# EAGLE design electronicload (EAGLE 8.5.0)
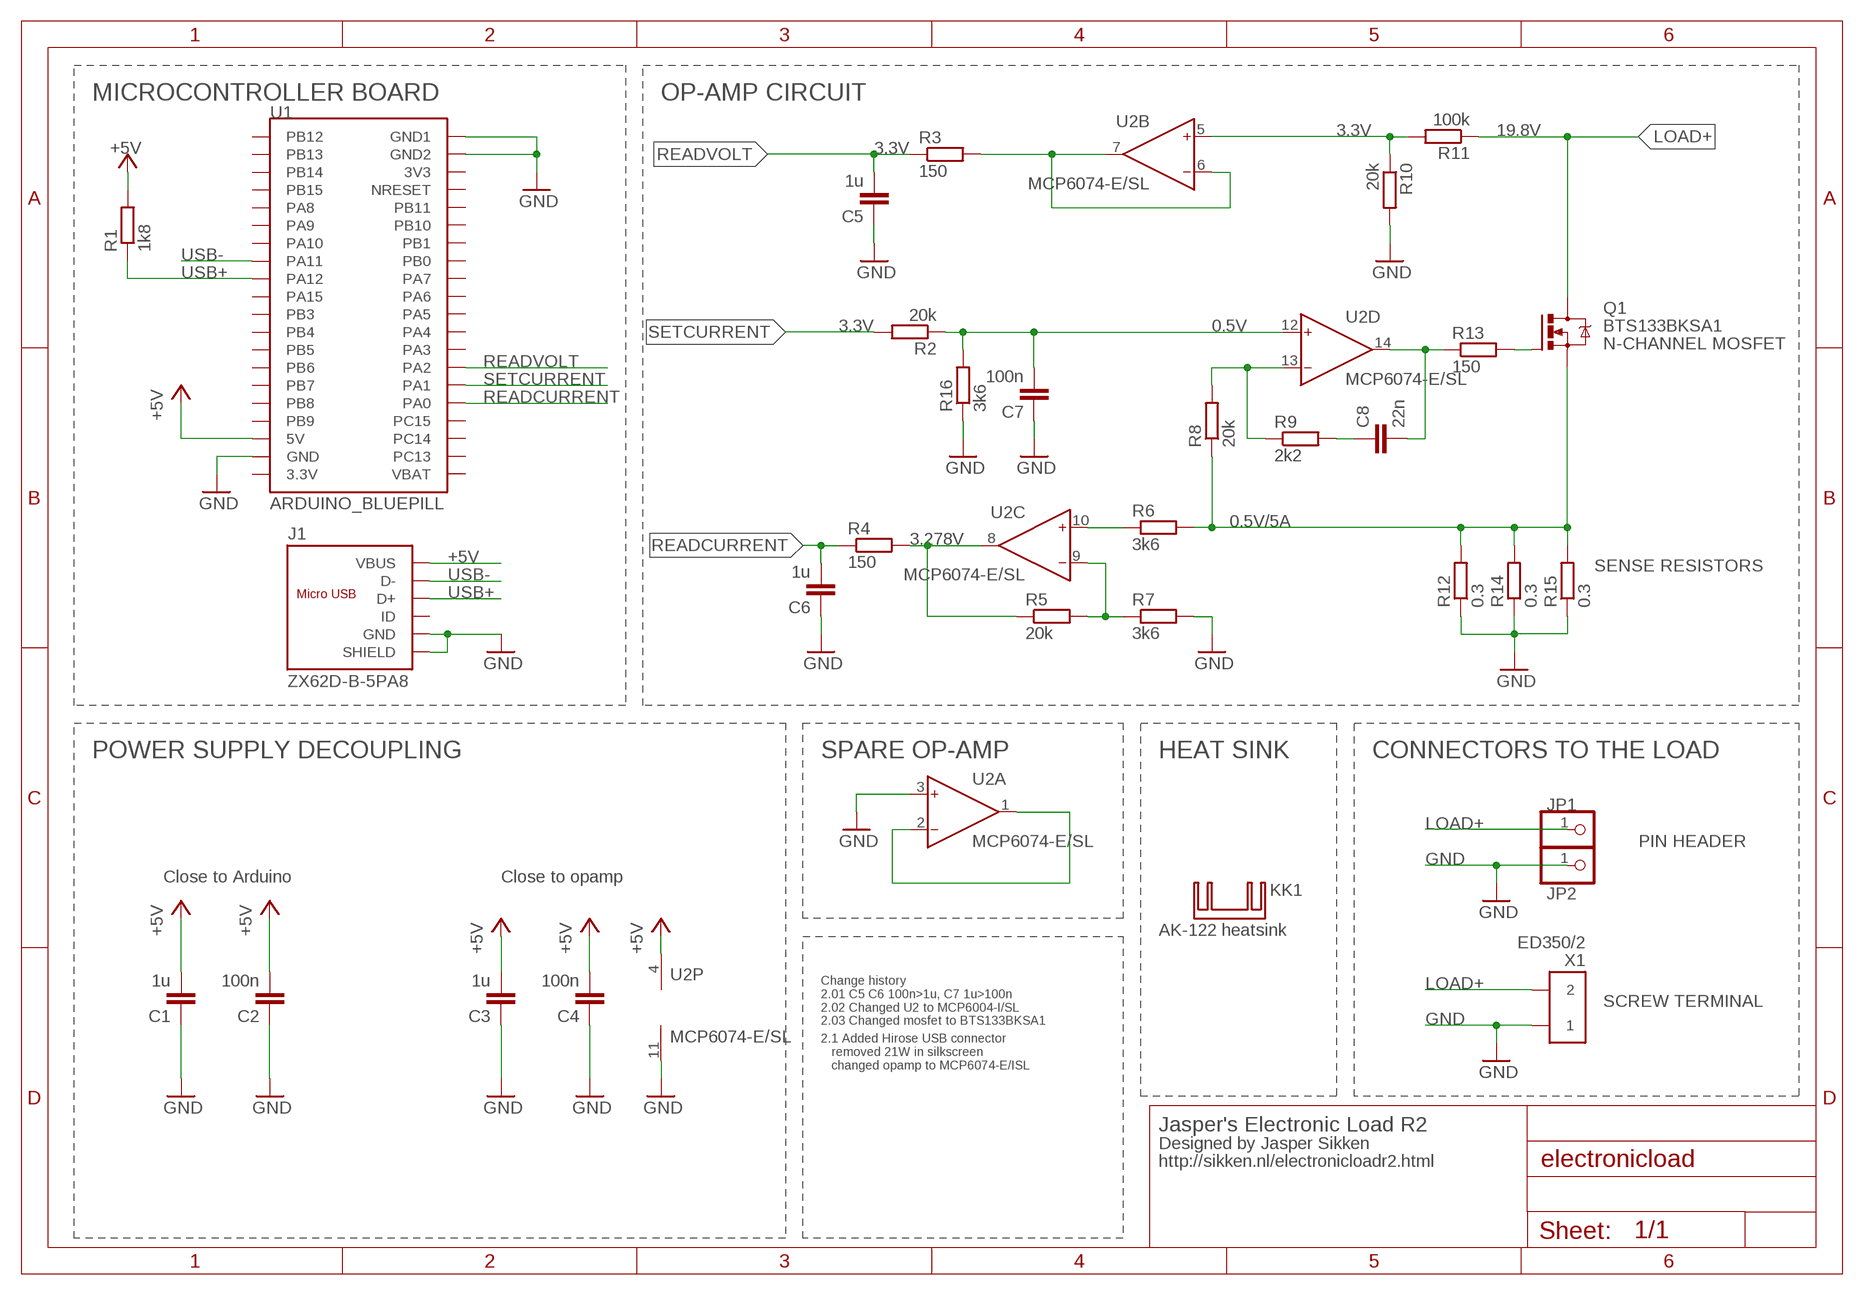
[diagram p0: schematic, sheet 1]

## Parts
C1  1u  C-EUC0603K  [C0603K]
C2  100n  C-EUC0603K  [C0603K]
C3  1u  C-EUC0603K  [C0603K]
C4  100n  C-EUC0603K  [C0603K]
C5  1u  C-EUC0603K  [C0603K]
C6  1u  C-EUC0603K  [C0603K]
C7  100n  C-EUC0603K  [C0603K]
C8  22n  C-EUC0603K  [C0603K]
J1  ZX62D-B-5PA8  MICRO-USB-SMD  [MICRO-USB5+6P-SMD-0.65-AB]
JP1  PINHD-1X1  [1X01]
JP2  PINHD-1X1  [1X01]
KK1  SK129  [SK129-HOLE]
Q1  BTS133BKSA1  IRLZ44Z  [TO220BV]
R1  1k8  R-EU_R0603  [R0603]
R2  20k  R-EU_R0603  [R0603]
R3  150  R-EU_R0603  [R0603]
R4  150  R-EU_R0603  [R0603]
R5  20k  R-EU_R0603  [R0603]
R6  3k6  R-EU_R0603  [R0603]
R7  3k6  R-EU_R0603  [R0603]
R8  20k  R-EU_R0603  [R0603]
R9  2k2  R-EU_R0603  [R0603]
R10  20k  R-EU_R0603  [R0603]
R11  100k  R-EU_R0603  [R0603]
R12  0.3  R2512_10R  [R2512]
R13  150  R-EU_R0603  [R0603]
R14  0.3  R2512_10R  [R2512]
R15  0.3  R2512_10R  [R2512]
R16  3k6  R-EU_R0603  [R0603]
U1  ARDUINO_BLUEPILL  [ARDUINO_BLUEPILL]
U2  MCP6074-E/SL  AD8608R  [SO14]
X1  ED350/2  [ED350/2]

## Nets
+5V: C1.2 C2.2 C3.2 C4.2 J1.1(VBUS) R1.2 U1.P$37(5V) U2.4(P:V+)
GATE: Q1.G R13.2
GND: C1.1 C2.1 C3.1 C4.1 C5.1 C6.1 C7.1 J1.5(GND) J1.P1(SHIELD) J1.P2(SHIELD) J1.P3(SHIELD) J1.P4(SHIELD) J1.P5(SHIELD) J1.P6(SHIELD) JP2.1 R7.2 R10.2 R12.1 R14.1 R15.1 R16.1 U1.P$18(GND2) U1.P$19(GND1) U1.P$38(GND) U2.3(A:IN+) U2.11(P:V-) X1.P$1
LOAD+: JP1.1 Q1.D R11.1 X1.P$2
N$1: C8.2 R13.1 U2.14(D:OUT)
N$2: R3.2 U2.6(B:IN-) U2.7(B:OUT)
N$3: R6.1 U2.10(C:IN+)
N$4: R8.2 R9.1 U2.13(D:IN-)
N$5: R10.1 R11.2 U2.5(B:IN+)
N$6: C7.2 R2.1 R16.2 U2.12(D:IN+)
N$7: R5.2 R7.1 U2.9(C:IN-)
N$9: R4.2 R5.1 U2.8(C:OUT)
N$12: C8.1 R9.2
N$20: U2.1(A:OUT) U2.2(A:IN-)
READCURRENT: C6.2 R4.1 U1.P$4(PA0)
READVOLT: C5.2 R3.1 U1.P$6(PA2)
SENSE: Q1.S R6.2 R8.1 R12.2 R14.2 R15.2
SETCURRENT: R2.2 U1.P$5(PA1)
USB+: J1.3(D+) R1.1 U1.P$28(PA12)
USB-: J1.2(D-) U1.P$27(PA11)
Unconnected: J1.4(ID) U1.P$0(VBAT) U1.P$1(PC13) U1.P$2(PC14) U1.P$3(PC15) U1.P$7(PA3) U1.P$8(PA4) U1.P$9(PA5) U1.P$10(PA6) U1.P$11(PA7) U1.P$12(PB0) U1.P$13(PB1) U1.P$14(PB10) U1.P$15(PB11) U1.P$16(NRESET) U1.P$17(3V3) U1.P$20(PB12) U1.P$21(PB13) U1.P$22(PB14) U1.P$23(PB15) U1.P$24(PA8) U1.P$25(PA9) U1.P$26(PA10) U1.P$29(PA15) U1.P$30(PB3) U1.P$31(PB4) U1.P$32(PB5) U1.P$33(PB6) U1.P$34(PB7) U1.P$35(PB8) U1.P$36(PB9) U1.P$39(3.3V)

## Notes on the sheet
- MICROCONTROLLER BOARD | OP-AMP CIRCUIT
- 3.3V | 19.8V
- 3.3V
- 3.3V | 0.5V
- N-CHANNEL MOSFET
- 0.5V/5A
- 3.278V
- SENSE RESISTORS
- POWER SUPPLY DECOUPLING | SPARE OP-AMP | HEAT SINK | CONNECTORS TO THE LOAD
- PIN HEADER
- Close to Arduino | Close to opamp
- AK-122 heatsink
- SCREW TERMINAL
- Change history
  2.01 C5 C6 100n>1u, C7 1u>100n
  2.02 Changed U2 to MCP6004-I/SL
  2.03 Changed mosfet to BTS133BKSA1
- 2.1 Added Hirose USB connector 
     removed 21W in silkscreen
     changed opamp to MCP6074-E/ISL
- Jasper's Electronic Load R2
- Designed by Jasper Sikken
- http://sikken.nl/electronicloadr2.html

## Library data of the parts
C1 C3 = rcl:C-EU: CAPACITOR, European symbol; DIGIKEY: 311-1444-1-ND; TEMPCOEFF: X5R; TOLERANCE: 10%; VOLTAGE: 16V
C2 C4-C6 = rcl:C-EU: CAPACITOR, European symbol; DIGIKEY: 445-7456-1-ND; TEMPCOEFF: X5R; TOLERANCE: 10%; VOLTAGE: 50V
C7 = rcl:C-EU: CAPACITOR, European symbol; DIGIKEY: 445-12511-1-ND; TEMPCOEFF: X5R; TOLERANCE: 10%; VOLTAGE: 50V
C8 = rcl:C-EU: CAPACITOR, European symbol; DIGIKEY: 445-12490-1-ND; TEMPCOEFF: X5R; TOLERANCE: 10%; VOLTAGE: 25V
J1 = sodaq:MICRO-USB-SMD: Micro USB connector; FARNELL_OC: 2554981; MF: Hirose; MPN: ZX62D-B-5PA8
JP1 JP2 = pinhead:PINHD-1X1: PIN HEADER
KK1 = heatsink:SK129: HEATSINK manufacturer Fischer/distributor Buerklin
Q1 = electronicload:IRLZ44Z: N-Channel HEXFET® Power MOSFET Logic Level AUTOMOTIVE MOSFET Source: http://www.irf.com/product-info/datasheets/data/irlz44zpbf.pdf; DIGIKEY: BTS133BKSA1-ND; FARNELL_OC: 2480556; MOUSER_OC: 726-BTS133BKSA1
R1 R2 R8 R16 = rcl:R-EU_: RESISTOR, European symbol; DIGIKEY: RMCF0603JT18K0CT-ND
R3 R4 R13 = rcl:R-EU_: RESISTOR, European symbol; DIGIKEY: RMCF0603JT150RCT-ND
R5 = rcl:R-EU_: RESISTOR, European symbol; DIGIKEY: RMCF0603JT180KCT-ND
R6 R7 R10 = rcl:R-EU_: RESISTOR, European symbol; DIGIKEY: RMCF0603JT20K0CT-ND
R9 = rcl:R-EU_: RESISTOR, European symbol; DIGIKEY: RMCF0603JT2K20CT-ND
R11 = rcl:R-EU_: RESISTOR, European symbol; DIGIKEY: RMCF0603JT100KCT-ND
R12 R14 R15 = sodaq:R: Resistor; FARNELL_OC: 2426553
U1 = electronicload:ARDUINO_BLUEPILL
U2 = electronicload:AD8608: Precision, Low Noise, CMOS, Rail-to-Rail, Input/Output Operational Amplifiers http://www.analog.com/static/imported-files/data_sheets/AD8605_8606_8608.pdf
X1 = electronicload:ED350/2: ED350/X (5.0 mm) TERMINAL BLOCK 5MM VERT 2POS PCB Datasheet http://www.on-shore.com/sites/default/files/manuals/edz350.pdf; DIGIKEY: ED1930-ND

## Board
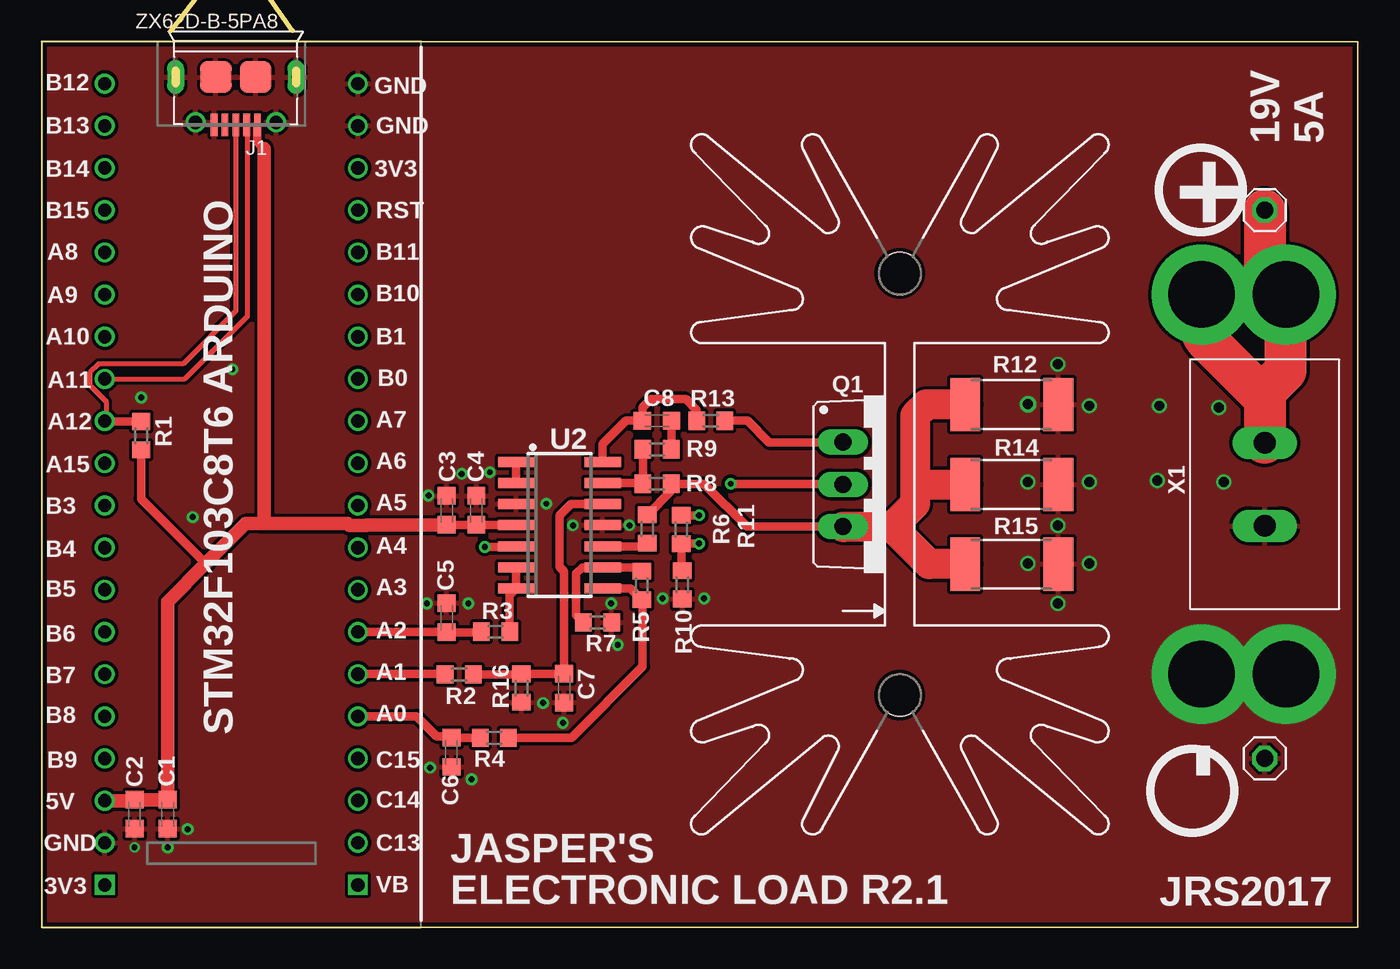
[diagram p1: board, top side]
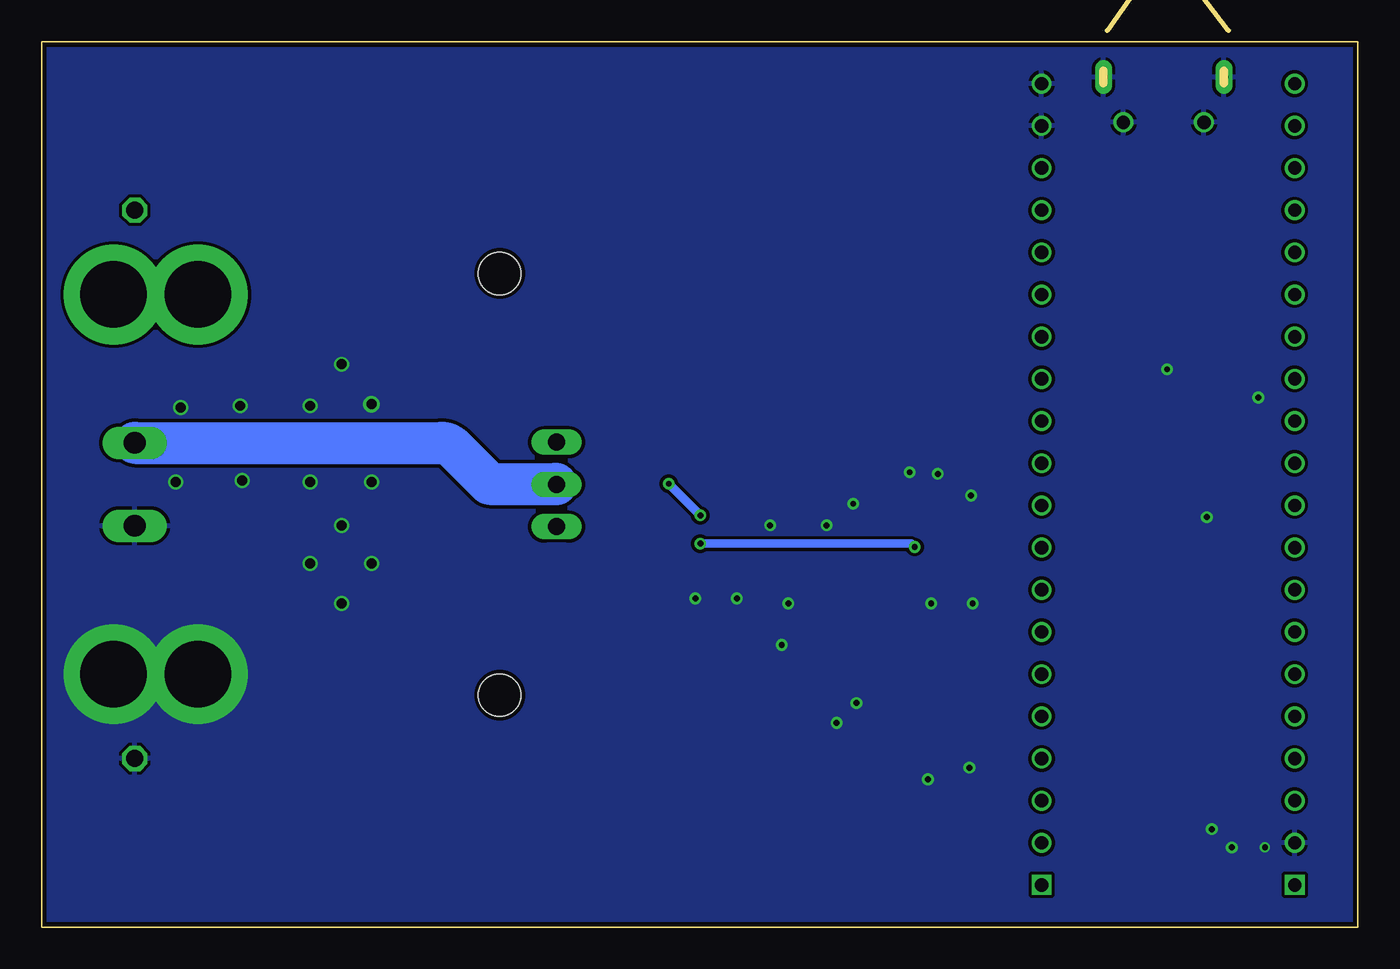
[diagram p2: board, bottom side, seen from below]

Size 79.27 x 53.34 mm. Coordinates in mm from the lower left corner, seen from the top.
Outline: 79.27,0 79.27,53.34 0,53.34 0,0 79.27,0
Copper layers (1*16): Top 0.018mm / dielectric 1.55mm / Bottom 0.018mm
Design rules "eC_2Layer_PClass6_BaseCopperO18_eCDefault (SODAQ EDIT) *": minimum track width 0.15mm, minimum drill 0.3mm, track to track 0.15mm, track to pad 0.15mm, pad to pad 0.15mm, via to via 0.15mm, smd to smd 0mil, copper to edge 0.25mm, drill to drill 0.3mm, minimum pad ring 0.175mm, minimum via ring 0.125mm, stop-mask expansion 0mil, vias tented up to drill 0.7mm, thermal gap 0.2mm
Milling: 2 lines

### Footprints (pad centres in the part's own frame; a part is rotated, then mirrored left to right if it is on the bottom)
C0603K = smd 1.05 x 1.08: 1 -0.875,0; 2 0.875,0
MICRO-USB5+6P-SMD-0.65-AB = smd 0.4 x 1.35: 1 -1.3,2.875; 2 -0.65,2.875; 3 0,2.875; 4 0.65,2.875; 5 1.3,2.875 | smd 1.9 x 1.9: P1 -1.2,0; P2 1.2,0 | drill 0.508 pad 1.016 long: P3 -3.625,0; P4 3.625,0 | drill 0.8: P5 -2.425,2.73; P6 2.425,2.73
1X01 = drill 1.016 octagon: 1 0,0
SK129-HOLE = hole 2.54: -12.7,-0.889; 12.7,-0.889
TO220BV = drill 1.016 long: D 0,-2.54; G -2.54,-2.54; S 2.54,-2.54
R0603 = smd 1 x 1.1: 1 -0.85,0; 2 0.85,0
R2512 = smd 1.8 x 3.2: 1 -2.8,0; 2 2.8,0
ARDUINO_BLUEPILL = drill 0.8 square: P$0 7.62,-24.13; P$39 -7.62,-24.13 | drill 0.8: P$1 7.62,-21.59; P$2 7.62,-19.05; P$3 7.62,-16.51; P$4 7.62,-13.97; P$5 7.62,-11.43; P$6 7.62,-8.89; P$7 7.62,-6.35; P$8 7.62,-3.81; P$9 7.62,-1.27; P$10 7.62,1.27; P$11 7.62,3.81; P$12 7.62,6.35; P$13 7.62,8.89; P$14 7.62,11.43; P$15 7.62,13.97; P$16 7.62,16.51; P$17 7.62,19.05; P$18 7.62,21.59; P$19 7.62,24.13; P$20 -7.62,24.13; P$21 -7.62,21.59; P$22 -7.62,19.05; P$23 -7.62,16.51; P$24 -7.62,13.97; P$25 -7.62,11.43; P$26 -7.62,8.89; P$27 -7.62,6.35; P$28 -7.62,3.81; P$29 -7.62,1.27; P$30 -7.62,-1.27; P$31 -7.62,-3.81; P$32 -7.62,-6.35; P$33 -7.62,-8.89; P$34 -7.62,-11.43; P$35 -7.62,-13.97; P$36 -7.62,-16.51; P$37 -7.62,-19.05; P$38 -7.62,-21.59
SO14 = smd 0.6 x 2.2: 1 -3.81,-2.6; 2 -2.54,-2.6; 3 -1.27,-2.6; 4 0,-2.6; 5 1.27,-2.6; 6 2.54,-2.6; 7 3.81,-2.6; 8 3.81,2.6; 9 2.54,2.6; 10 1.27,2.6; 11 0,2.6; 12 -1.27,2.6; 13 -2.54,2.6; 14 -3.81,2.6
ED350/2 = drill 1.3 long: P$1 0,-2.5; P$2 0,2.5

### Placement (x,y rotation side)
C1  7.6,6.8 90 top
C2  5.6,6.8 90 top
C3  24.4,25.1 270 top
C4  26.18,25.1 270 top
C5  24.4,18.64 270 top
C6  24.68,10.53 90 top
C7  31.47,14.4 90 top
C8  37.06,30.5 180 top
J1  11.7,51.2 180 top
JP1  73.66,43.18 0 top
JP2  73.66,10.16 0 top
KK1  50.8,26.67 90 top
Q1  50.8,26.67 270 top
R1  6,29.6 270 top
R2  25.15,15.22 180 top
R3  27.34,17.8 0 top
R4  27.27,11.4 0 top
R5  36.15,20.58 90 top
R6  36.48,23.98 90 top
R7  33.48,18.35 0 top
R8  37.06,26.71 180 top
R9  37.06,28.78 0 top
R10  38.59,20.62 270 top
R11  38.52,23.95 270 top
R12  58.42,31.48 180 top
R13  40.3,30.5 0 top
R14  58.42,26.67 180 top
R15  58.42,21.86 180 top
R16  28.9,14.4 90 top
U1  11.43,26.67 0 top
U2  31.19,24.21 270 top
X1  73.66,26.67 0 top

### Tracks (layer width: path | path; a pad name or v marks a point on that pad's centre or on a via)
+5V
  Top 0.508: U2.4 26.2,24.21 C4.2 C3.2 | 5.54,7.62 C2.2 | R1.2 6,25.8 9.9,21.9 | J1.1 13,47.3 13.4,46.9
  Top 0.813: 13.2,24.3 12.3,24.3 9.9,21.9 7.6,19.6 C1.2 5.68,7.67 arc45 5.54,7.62 U1.P$37 | 13.2,24.3 18.43,24.3 18.55,24.19 19.55,24.19 19.59,24.23 C3.2 | 13.4,46.9 13.4,24.5 13.2,24.3
GATE
  Top 0.508: R13.2 42.5,30.5 43.8,29.2 Q1.G
GND  (via drill 0.35, 0.35 pad 0.7, 0.6, 0.6 pad 1, 4 pad 6)
  other vias: 69.85,15.24 74.93,15.24 30.4,25.5 32,24.2 34.7,17 31.4,12.3 30.2,13.5 25.9,8.9 23.4,9.6 23.2,19.5 25.7,19.5 23.3,26 25.3,27.3 27,27.4 34.3,19.5 5.6,4.8 7.6,4.8 8.8,5.9 35.4,24.2 37.4,19.8 39.9,19.8 61.2,19.5 59.4,21.9 63.1,21.9 61.2,24.2 59.4,26.8 63.1,26.8 63.1,31.4 59.4,31.5 61.2,33.9 67.2,26.9 67.3,31.4 70.9,31.3 71.2,26.8 6,31.9 11.5,33.6 9.1,24.7
  pour Top (isolate 0.2): 0,0 79.27,0 79.27,53.34 0,53.34
  pour Bottom (isolate 0.2): 0,0 79.27,0 79.27,53.34 0,53.34
LOAD+  (via drill 0.35 pad 0.7, 4 pad 6)
  Top 0.508: v39.6,24.8 R11.1 | v41.5,26.7 48.23,26.7 Q1.D
  Top 2.54: 73.66,31.85 X1.P$2 | 73.66,31.85 arc-45 73.95,32.55 74.9,33.5 74.9,38.03 | 74.9,38.03 arc-45 v74.93,38.1 | v69.85,38.1 69.85,36.07 arc45 70.14,35.36 73.66,31.85 | JP1.1 73.66,39.68 arc45 73.95,38.98 74.9,38.03
  Bottom 0.508: v39.6,24.8 v41.5,26.7
  Bottom 2.54: X1.P$2 55.18,29.17 arc45 54.48,28.88 52.3,26.7 48.33,26.7 arc45 Q1.D
N$1
  Top 0.508: U2.14 33.79,29.09 35.2,30.5 C8.2 36.2,31.3 36.7,31.8 38.8,31.8 39.45,31.15 R13.1
N$2
  Top 0.508: R3.2 28.19,20 U2.7 U2.6
N$3
  Top 0.508: U2.10 35.99,22.94 R6.1
N$4
  Top 0.508: U2.13 36.17,26.75 R8.2 R9.1
N$5  (via drill 0.35 pad 0.7)
  Top 0.508: R10.1 38.52,21.43 R11.2 v39.6,23.1 | v26.7,22.9 28.55,22.9 U2.5
  Bottom 0.508: v39.6,23.1 26.9,23.1 v26.7,22.9
N$6
  Top 0.508: R2.1 28.87,15.22 R16.2 31.45,15.25 C7.2 31.47,21.43 31.2,21.7 31.2,24.8 31.9,25.5 33.77,25.5 U2.12
N$7
  Top 0.508: R5.2 35.91,21.67 U2.9 32.57,21.67 32.2,21.3 32.2,18.79 R7.1
N$9
  Top 0.508: R4.2 31.9,11.4 36.2,15.7 36.2,19.68 R5.1 35.48,20.4 U2.8
N$12
  Top 0.508: C8.1 37.94,28.8 R9.2
N$20
  Top 0.508: U2.1 U2.2
READCURRENT
  Top 0.508: U1.P$4 22.6,12.7 23.8,11.5 24.59,11.5 C6.2 R4.1
READVOLT
  Top 0.508: U1.P$6 24.39,17.78 C5.2 26.46,17.77 R3.1
SENSE
  Top 0.508: Q1.S 42.47,24.13 39.9,26.7 R8.1 37.91,26.27 R6.2 36.18,24.88
  Top 1.8: R14.2 52.63,26.67 52.6,26.7 | 52.6,26.7 52.6,25.5 51.2,24.1 | 51.2,24.1 48.29,24.1 Q1.S | R15.2 53.44,21.86 51.2,24.1 | R12.2 53.28,31.48 52.6,30.8 52.6,26.7
SETCURRENT
  Top 0.508: U1.P$5 24.28,15.24 R2.2
USB+
  Top 0.305: J1.3 11.7,37.1 8.52,33.92 3.44,33.92 2.91,33.39 2.91,32.65 3.88,31.67 3.88,30.45
  Top 0.508: R1.1 3.88,30.45 arc-45 U1.P$28
USB-
  Top 0.305: U1.P$27 8.62,33.02 12.4,36.8 12.4,48.27 J1.2

### Text on the board
tPlace: 19V / 5A | + | STM32F103C8T6 ARDUINO | - | JASPER'S | ELECTRONIC LOAD R2.1 | JRS2017
Milling: Please note / two plates slots